# Altium schematic sheet joystick.SchDoc: TEAM JX Simon
size 431 x 279 mm; Date: 02/16/2021; ApprovedBy: Chengyang Xi; CheckedBy: Jiahong Ji; Author: Chengyang Xi; CompanyName: UPenn; DrawnBy: Jiahong Ji; Engineer: Chengyang Xi
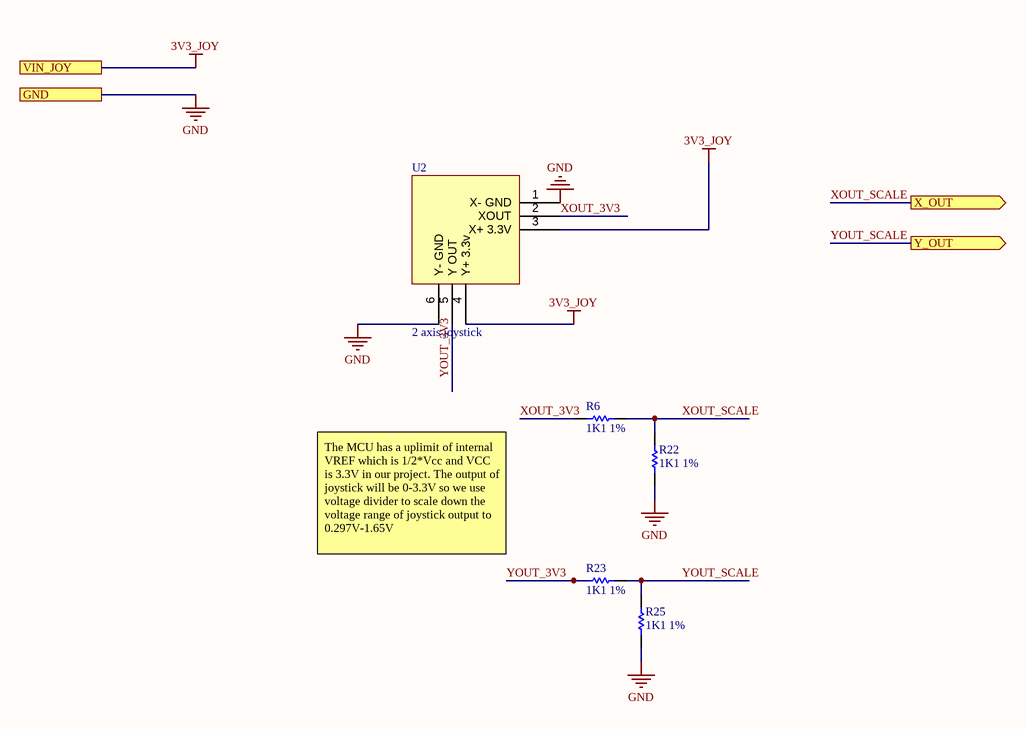
[diagram p0: joystick.SchDoc]

## Parts
R6  1K1 1%  [RESC0603(1608)_N]
R22  1K1 1%  [RESC0603(1608)_N]
R23  1K1 1%  [RESC0603(1608)_N]
R25  1K1 1%  [RESC0603(1608)_N]
U2  2 axis joystick  [JOYSTICK]

## Ports
GND, VIN_JOY, X_OUT (out), Y_OUT (out)

## Nets
3V3_JOY: U2.3(X+_3.3V) U2.4(Y+_3.3v) ; port VIN_JOY
GND: R22.1 R25.1 U2.1(X-_GND) U2.6(Y-_GND) ; port GND
XOUT_3V3: R6.1 U2.2(XOUT)
XOUT_SCALE: R6.2 R22.2 ; port X_OUT
YOUT_3V3: R23.1 U2.5(Y_OUT)
YOUT_SCALE: R23.2 R25.2 ; port Y_OUT

## Notes on the sheet
- The MCU has a uplimit of internal VREF which is 1/2*Vcc and VCC is 3.3V in our project. The output of joystick will be 0-3.3V so we use voltage divider to scale down the voltage range of joystick output to 0.297V-1.65V
- DWG. NO.
- REV.
- SHT.
- THIS DOCUMENT AND THE DATA DISCLOSED HEREIN OR HEREWITH IS THE PROPERTY OF ALTIUM LIMITED AND MAY BE FREELY DISTRIBUTED IN WHOLE. NO RIGHTS ARE RESERVED OR EXPRESS OR IMPLIED WARANTEE GIVEN.
- REVISION
- DESCRIPTION
- DATE
- APPROVED
- ENG:
- APPROVALS
- PROJECT
- DSN:
- CHK:
- REFERENCE DOCUMENTS
- PROJECT REVISION:
- TITLE
- DOCUMENT REVISION:
- DESIGN ITEM:
- BOM:
- FAB DWG:
- PCB DWG:
- ASSY DWG:
- SCALE:
- SIZE
- B
- CAGE CODE
- FILE NAME
- DWG NO.
- SHEET
- OF
- REV

## Library data of the parts
R6 R22 R23 R25 = CMP-1012-00514-1: 1K1 0.1W 1% 0603 (1608 Metric)  SMD; Case-Metric: 1608; Case-EIA: 0603; Value: 1100.00 Ohm; Technology: SMT; Tolerance: 1 %; Power: 0.1 W
U2 = Adafruit 2765: JOYSTICK 10K OHM 2 AXIS TH; Manufacturer: Adafruit Industries; Manufacturer Part Number: 2765; Resistance: 10kR; Supplier 1: Digi-Key; RoHS: Yes; Stock 1: 17; Pricing 1: 1=2.50000 (USD); Mount: Through Hole; Packaging: Bulk; Length: 0.707inch; Width: 0.697inch; Height: 0.472inch; ComponentLink1URL: https://media.digikey.com/pdf/Data%20Sheets/Adafruit%20PDFs/2765_Web.pdf?src-supplier=Digi-Key; ComponentLink1Description: https://media.digikey.com/pdf/Data%20Sheets/Adafruit%20PDFs/2765_Web.pdf?src-supplier=Digi-Key; Supplier Part Number 1: 1528-1730-ND